# Altium schematic sheet controllers.SchDoc
size A; SheetNumber: 1; SheetTotal: 2
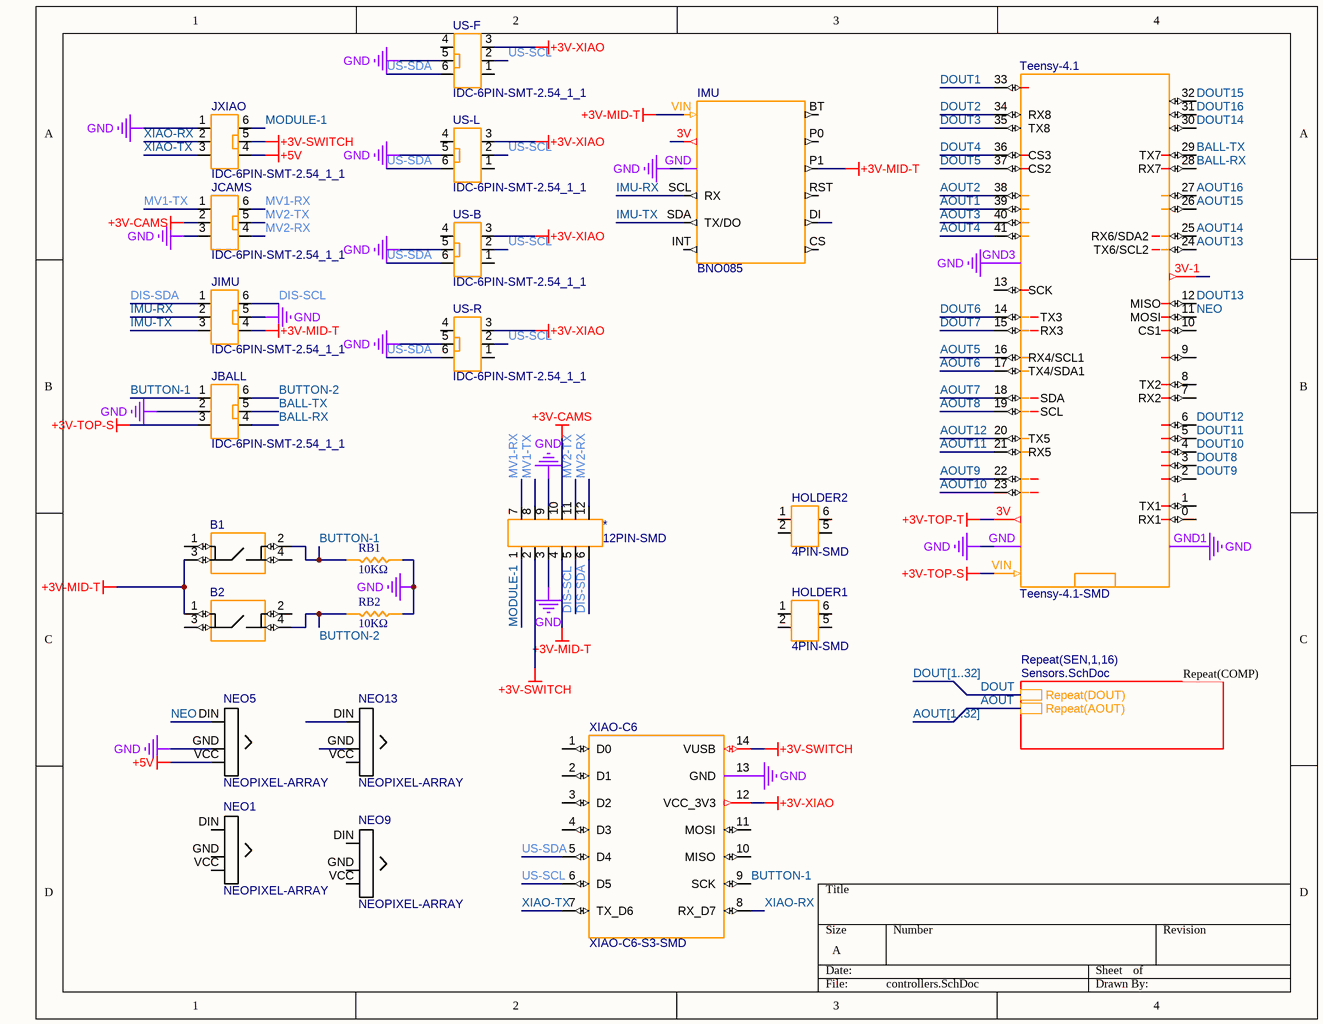
[diagram p0: controllers.SchDoc]

## Parts
*  12PIN-SMD  [12PIN-SMD]
B1  BUTTON  [BUTTON]  (value not drawn)
B2  BUTTON  [BUTTON]  (value not drawn)
HOLDER1  4PIN-SMD  [4PIN-SMD]
HOLDER2  4PIN-SMD  [4PIN-SMD]
IMU  BNO085  [BNO085]
JBALL  IDC-6PIN-SMT-2.54_1_1  [IDC-6PIN-SMT-2.54]
JCAMS  IDC-6PIN-SMT-2.54_1_1  [IDC-6PIN-SMT-2.54]
JIMU  IDC-6PIN-SMT-2.54_1_1  [IDC-6PIN-SMT-2.54]
JXIAO  IDC-6PIN-SMT-2.54_1_1  [IDC-6PIN-SMT-2.54]
NEO1  NEOPIXEL-ARRAY  [NEOPIXEL-ARRAY]
NEO5  NEOPIXEL-ARRAY  [NEOPIXEL-ARRAY]
NEO9  NEOPIXEL-ARRAY  [NEOPIXEL-ARRAY]
NEO13  NEOPIXEL-ARRAY  [NEOPIXEL-ARRAY]
RB1  10KΩ  [RES_0603]
RB2  10KΩ  [RES_0603]
Teensy-4.1  Teensy-4.1-SMD  [TEENSY-4.1-SMD]
US-B  IDC-6PIN-SMT-2.54_1_1  [IDC-6PIN-SMT-2.54]
US-F  IDC-6PIN-SMT-2.54_1_1  [IDC-6PIN-SMT-2.54]
US-L  IDC-6PIN-SMT-2.54_1_1  [IDC-6PIN-SMT-2.54]
US-R  IDC-6PIN-SMT-2.54_1_1  [IDC-6PIN-SMT-2.54]
XIAO-C6  XIAO-C6-S3-SMD  [XIAO-C6-S3-SMD]

## Sub-sheets
Repeat(SEN,1,16) = Sensors.SchDoc: Repeat(DOUT), Repeat(AOUT)

## Nets
+3V-CAMS: *.10 JCAMS.2
+3V-MID-T: *.4 B1.3 B2.1 IMU.P1 IMU.VIN JIMU.4
+3V-SWITCH: *.2 JXIAO.5 XIAO-C6.14(VUSB)
+3V-TOP-S: JBALL.3 Teensy-4.1.VIN
+3V-TOP-T: Teensy-4.1.3V
+3V-XIAO: US-B.3 US-F.3 US-L.3 US-R.3 XIAO-C6.12(VCC_3V3)
+5V: JXIAO.4 NEO5.VCC
GND: *.3 *.9 IMU.GND JBALL.2 JCAMS.3 JIMU.5 JXIAO.1 NEO5.GND RB1.2 RB2.2 Teensy-4.1.GND Teensy-4.1.GND1 Teensy-4.1.GND3 US-B.5 US-F.5 US-L.5 US-R.5 XIAO-C6.13(GND)
AOUT: sheet Repeat(SEN,1,16)/Repeat(AOUT)
AOUT1: Teensy-4.1.39
AOUT2: Teensy-4.1.38
AOUT3: Teensy-4.1.40
AOUT4: Teensy-4.1.41
AOUT5: Teensy-4.1.16(RX4/SCL1)
AOUT6: Teensy-4.1.17(TX4/SDA1)
AOUT7: Teensy-4.1.18(SDA)
AOUT8: Teensy-4.1.19(SCL)
AOUT9: Teensy-4.1.22
AOUT10: Teensy-4.1.23
AOUT11: Teensy-4.1.21(RX5)
AOUT12: Teensy-4.1.20(TX5)
AOUT13: Teensy-4.1.24(TX6/SCL2)
AOUT14: Teensy-4.1.25(RX6/SDA2)
AOUT15: Teensy-4.1.26
AOUT16: Teensy-4.1.27
BALL-RX: JBALL.4 Teensy-4.1.28(RX7)
BALL-TX: JBALL.5 Teensy-4.1.29(TX7)
BUTTON-1: B1.2 JBALL.1 RB1.1 XIAO-C6.9(SCK)
BUTTON-2: B2.4 JBALL.6 RB2.1
DIS-SCL: *.5 JIMU.6
DIS-SDA: *.6 JIMU.1
DOUT: sheet Repeat(SEN,1,16)/Repeat(DOUT)
DOUT1: Teensy-4.1.33
DOUT2: Teensy-4.1.34(RX8)
DOUT3: Teensy-4.1.35(TX8)
DOUT4: Teensy-4.1.36(CS3)
DOUT5: Teensy-4.1.37(CS2)
DOUT6: Teensy-4.1.14(TX3)
DOUT7: Teensy-4.1.15(RX3)
DOUT8: Teensy-4.1.3
DOUT9: Teensy-4.1.2
DOUT10: Teensy-4.1.4
DOUT11: Teensy-4.1.5
DOUT12: Teensy-4.1.6
DOUT13: Teensy-4.1.12(MISO)
DOUT14: Teensy-4.1.30
DOUT15: Teensy-4.1.32
DOUT16: Teensy-4.1.31
IMU-RX: IMU.SCL(RX) JIMU.2
IMU-TX: IMU.SDA(TX/DO) JIMU.3
MODULE-1: *.1 JXIAO.6
MV1-RX: *.7 JCAMS.6
MV1-TX: *.8 JCAMS.1
MV2-RX: *.12 JCAMS.4
MV2-TX: *.11 JCAMS.5
NEO: NEO5.DIN Teensy-4.1.11(MOSI)
US-SCL: US-B.2 US-F.2 US-L.2 US-R.2 XIAO-C6.6(D5)
US-SDA: US-B.6 US-F.6 US-L.6 US-R.6 XIAO-C6.5(D4)
XIAO-RX: JXIAO.2 XIAO-C6.8(RX_D7)
XIAO-TX: JXIAO.3 XIAO-C6.7(TX_D6)

Not connected (* = marked no-connect by the designer): B1 1 4; B2 2 3; HOLDER1 1 2 5 6; HOLDER2 1 2 5 6; IMU 3V BT CS DI INT P0 RST; NEO1 DIN GND VCC; NEO9 DIN GND VCC; NEO13 DIN GND VCC; Teensy-4.1 0(RX1) 1(TX1) 3V-1 7(RX2) 8(TX2) 9 10(CS1) 13(SCK); US-B 1 4; US-F 1 4; US-L 1 4; US-R 1 4; XIAO-C6 1(D0) 2(D1) 3(D2) 4(D3) 10(MISO) 11(MOSI)

## Buses and harness runs
bus AOUT[1..32]
bus DOUT[1..32]

## Notes on the sheet
- Repeat(COMP)

## Library data of the parts
RB1 RB2 = RES_0603: Resistor SMD 0603 generic